# EAGLE design main_board (EAGLE 6.5.0)
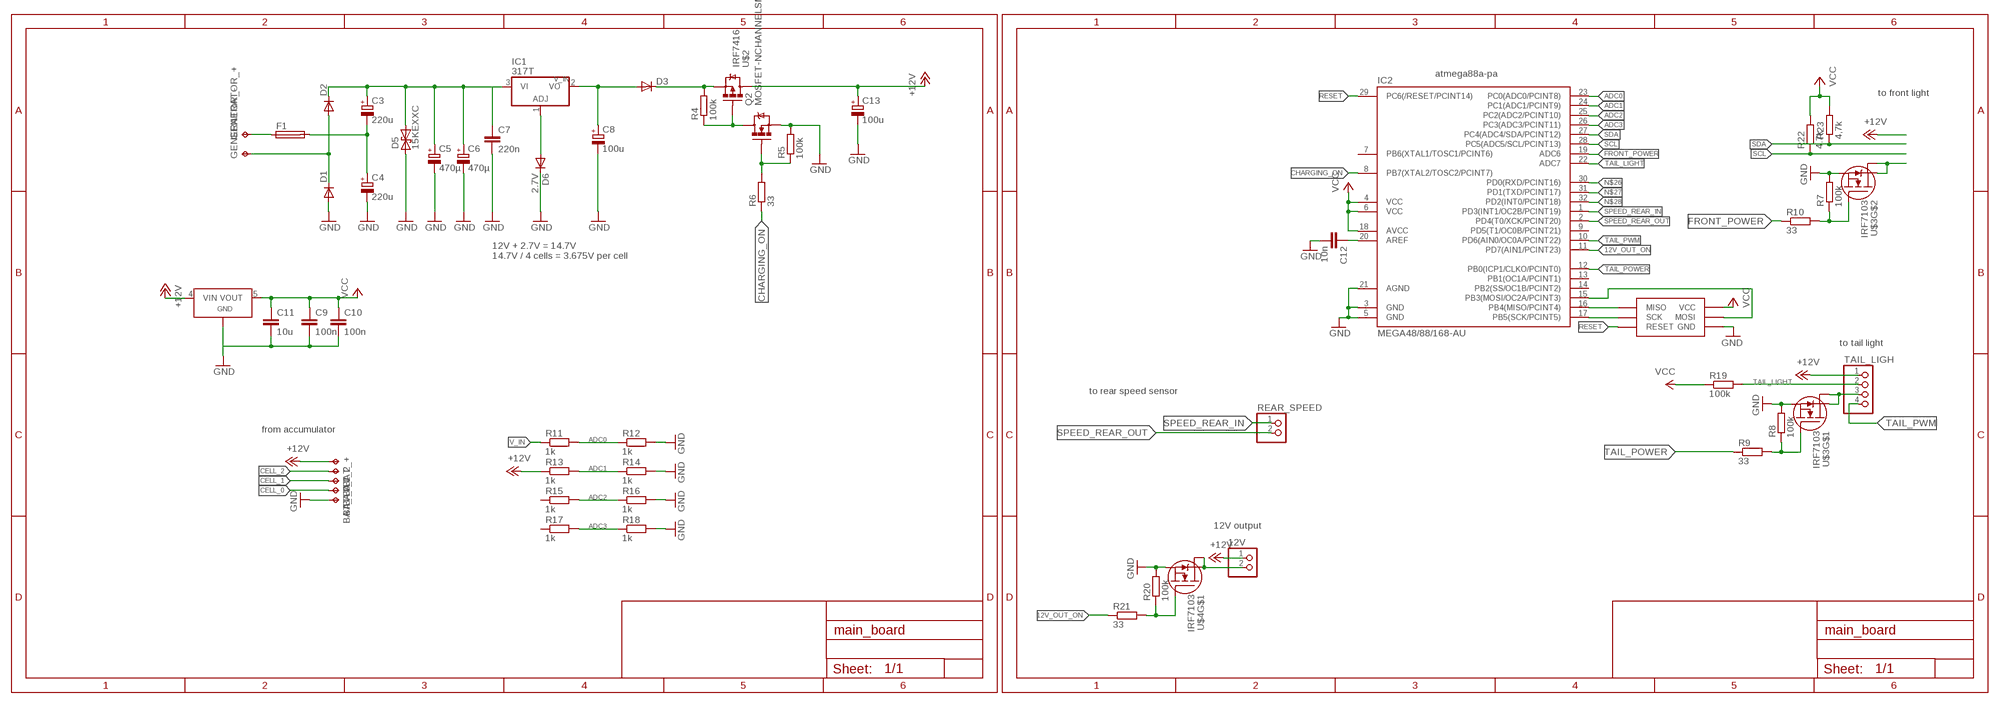
[diagram p0: schematic, sheet 1]

## Parts
12V  PINHD-1X2  [1X02]
BAT_0  TPTP18SQ  [TP18SQ]
BAT_1  TPTP18SQ  [TP18SQ]
BAT_2  TPTP18SQ  [TP18SQ]
BAT_+  TPTP18SQ  [TP18SQ]
BAT_-  TPTP18SQ  [TP18SQ]
C3  220u  CPOL-EUF  [PANASONIC_F]
C4  220u  CPOL-EUF  [PANASONIC_F]
C5  470µ  CPOL-EU153CLV-1014  [153CLV-1014]
C6  470µ  CPOL-EU153CLV-1014  [153CLV-1014]
C7  220n  C-EUC0805  [C0805]
C8  100u  CPOL-EUE  [PANASONIC_E]
C9  100n  C-EUC0805  [C0805]
C10  100n  C-EUC0805  [C0805]
C11  10u  C-EUC1206  [C1206]
C12  10n  C-EUC0805  [C0805]
C13  100u  CPOL-EUE  [PANASONIC_E]
D1  DIODE-DO-214AC  [DO-214AC]
D2  DIODE-DO-214AC  [DO-214AC]
D3  DIODE-DO-214AC  [DO-214AC]
D5  15KEXXC  [CB429-17]
D6  2.7V  DIODE-MINIMELF  [MINIMELF]
F1  TE5  [TE5]
GENERATOR_+  TPTP18SQ  [TP18SQ]
GENERATOR_-  TPTP18SQ  [TP18SQ]
IC1  317T  [TO220H]
IC2  MEGA48/88/168-AU  [TQFP32-08]
Q2  MOSFET-NCHANNELSMD  [SOT23-3]
R4  100k  R-EU_R0603  [R0603]
R5  100k  R-EU_R0603  [R0603]
R6  33  R-EU_R0603  [R0603]
R7  100k  R-EU_R0603  [R0603]
R8  100k  R-EU_R0603  [R0603]
R9  33  R-EU_R0603  [R0603]
R10  33  R-EU_R0603  [R0603]
R11  1k  R-EU_R0603  [R0603]
R12  1k  R-EU_R0603  [R0603]
R13  1k  R-EU_R0603  [R0603]
R14  1k  R-EU_R0603  [R0603]
R15  1k  R-EU_R0603  [R0603]
R16  1k  R-EU_R0603  [R0603]
R17  1k  R-EU_R0603  [R0603]
R18  1k  R-EU_R0603  [R0603]
R19  100k  R-EU_R0603  [R0603]
R20  100k  R-EU_R0603  [R0603]
R21  33  R-EU_R0603  [R0603]
R22  4.7k  R-EU_R0603  [R0603]
R23  4,7k  R-EU_R0603  [R0603]
REAR_SPEED  PINHD-1X2  [1X02]
TAIL_LIGH  PINHD-1X4  [1X04]
U$1  TPS71530  [SOT23-DBV]
U$2  IRF7416  [SO8-2]
U$3  IRF7103  [SO8-2]
U$4  IRF7103  [SO8-2]
U$5  ISP_SPECIALS  [ISP_RM2_00_STRAIGHT]

## Nets
12V_OUT_ON: IC2.11(PD7(AIN1/PCINT23)) R21.1
+12V: 12V.1 BAT_+.TP C13.+ R13.1 TAIL_LIGH.1 U$1.4(VIN) U$2.5(D1) U$2.6(D1) U$2.7(D1) U$2.8(D1)
ADC0: IC2.23(PC0(ADC0/PCINT8)) R11.2 R12.1
ADC1: IC2.24(PC1(ADC1/PCINT9)) R13.2 R14.1
ADC2: IC2.25(PC2(ADC2/PCINT10)) R15.2 R16.1
ADC3: IC2.26(PC3(ADC3/PCINT11)) R17.2 R18.1
CELL_0: BAT_0.TP
CELL_1: BAT_1.TP
CELL_2: BAT_2.TP
CHARGING_ON: IC2.8(PB7(XTAL2/TOSC2/PCINT7)) R6.1
FRONT_POWER: IC2.19(ADC6) R10.1
GND: BAT_-.TP C4.- C5.- C6.- C7.2 C8.- C9.2 C10.2 C11.2 C12.2 C13.- D1.A D5.A D6.C IC2.3(GND) IC2.5(GND) IC2.21(AGND) Q2.2(S) R5.2 R7.2 R8.2 R12.2 R14.2 R16.2 R18.2 R20.2 U$1.2(GND) U$3.1(S) U$3.3(S) U$4.1(S) U$5.VCC(GND)
N$1: D3.C R4.2 U$2.1(S1) U$2.2(S1) U$2.3(S1)
N$2: C12.1 IC2.20(AREF)
N$4: D1.C D2.A GENERATOR_-.TP
N$5: 12V.2 U$4.7(D) U$4.8(D)
N$7: IC2.17(PB5(SCK/PCINT5)) U$5.SCK
N$8: C3.- C4.+ F1.2
N$9: F1.1 GENERATOR_+.TP
N$10: D6.A IC1.1(ADJ)
N$12: IC2.16(PB4(MISO/PCINT4)) U$5.RESET(MISO)
N$13: U$3.5(D) U$3.6(D)
N$16: Q2.3(D) R4.1 U$2.4(G)
N$17: Q2.1(G) R5.1 R6.2
N$18: TAIL_LIGH.3 U$3.7(D) U$3.8(D)
N$19: R7.1 R10.2 U$3.4(G)
N$20: R8.1 R9.2 U$3.2(G)
N$21: IC2.15(PB3(MOSI/OC2A/PCINT3)) U$5.MOSI
N$22: R20.1 R21.2 U$4.2(G)
N$24: C8.+ D3.A IC1.2(VO)
N$26: IC2.30(PD0(RXD/PCINT16))
N$27: IC2.31(PD1(TXD/PCINT17))
N$28: IC2.32(PD2(INT0/PCINT18))
RESET: IC2.29(PC6(/RESET/PCINT14)) U$5.MISO(RESET)
SCL: IC2.28(PC5(ADC5/SCL/PCINT13)) R22.1
SDA: IC2.27(PC4(ADC4/SDA/PCINT12)) R23.1
SPEED_REAR_IN: IC2.1(PD3(INT1/OC2B/PCINT19)) REAR_SPEED.1
SPEED_REAR_OUT: IC2.2(PD4(T0/XCK/PCINT20)) REAR_SPEED.2
TAIL_LIGHT: IC2.22(ADC7) R19.2 TAIL_LIGH.2
TAIL_POWER: IC2.12(PB0(ICP1/CLKO/PCINT0)) R9.1
TAIL_PWM: IC2.10(PD6(AIN0/OC0A/PCINT22)) TAIL_LIGH.4
V_IN: C3.+ C5.+ C6.+ C7.1 D2.C D5.C IC1.3(VI) R11.1
VCC: C9.1 C10.1 C11.1 IC2.4(VCC) IC2.6(VCC) IC2.18(AVCC) R19.1 R22.2 R23.2 U$1.5(VOUT) U$5.GND(VCC)
Unconnected: IC2.7(PB6(XTAL1/TOSC1/PCINT6)) IC2.9(PD5(T1/OC0B/PCINT21)) IC2.13(PB1(OC1A/PCINT1)) IC2.14(PB2(SS/OC1B/PCINT2)) R15.1 R17.1 U$4.3(S) U$4.4(G) U$4.5(D) U$4.6(D)

## Notes on the sheet
- atmega88a-pa
- to front light
- 12V + 2.7V = 14.7V
  14.7V / 4 cells = 3.675V per cell
- to tail light
- to rear speed sensor
- from accumulator
- 12V output

## Library data of the parts
12V REAR_SPEED = pinhead:PINHD-1X2: PIN HEADER
BAT_0 BAT_1 BAT_2 BAT_+ BAT_- GENERATOR_+ GENERATOR_- = testpad:TP: Test pad
C3-C6 C8 C13 = resistor:CPOL-EU: POLARIZED CAPACITOR, European symbol
C7 C9-C12 = resistor:C-EU: CAPACITOR, European symbol
D1-D3 D6 = diode:DIODE-: DIODE
D5 = diode:15KEXXC: DIODE
F1 = fuse:TE5: FUSE Wickmann; OC_FARNELL: unknown; OC_NEWARK: unknown
IC1 = linear:*317: Positive VOLTAGE REGULATOR
IC2 = avr-7:MEGA48/88/168
Q2 = SparkFun:MOSFET-NCHANNEL
R4-R23 = resistor:R-EU_: RESISTOR, European symbol
TAIL_LIGH = pinhead:PINHD-1X4: PIN HEADER
U$1 = ShortCircuitRobotics:TPS71530
U$2 = ShortCircuitRobotics:IRF7416
U$3 U$4 = irf-2:IRF7103: HEXFET® Power MOSFET Adavanced Process Technology Ultra Low On-Resistance Dual N-Channel MOSFET Surface Mount Available in Tape & Reel Dynamic dv/dt Rating Fast Switching Please connect both Drain-Pins of each FET for thermal Reasons! (Pin 5 with Pin 6, 7 with 8)
U$5 = bookla:ISP_SPECIAL

## Board
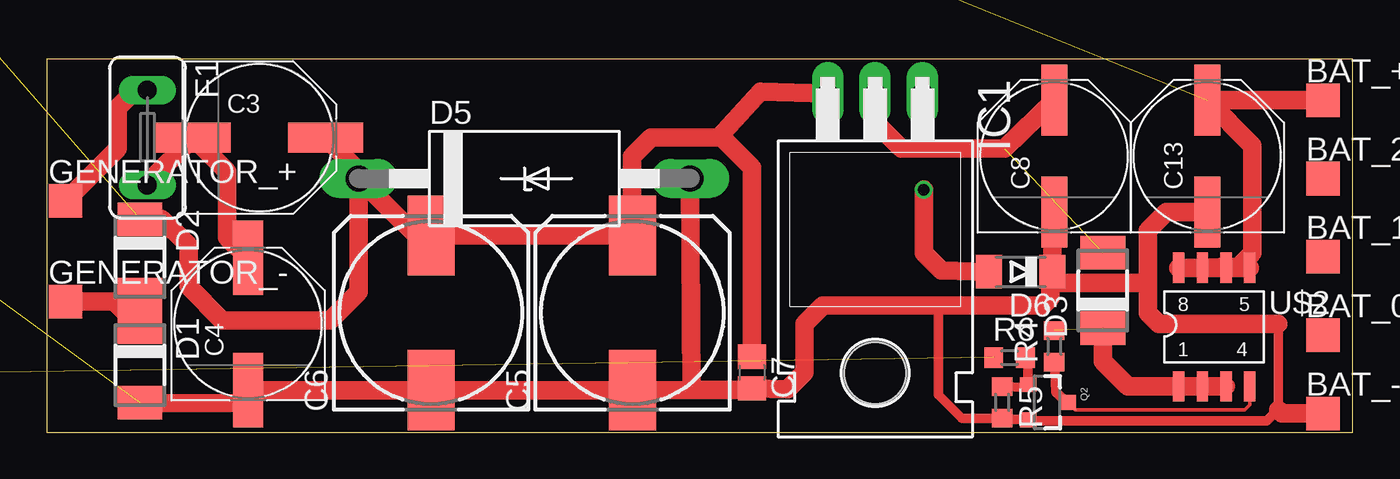
[diagram p1: board, top side]
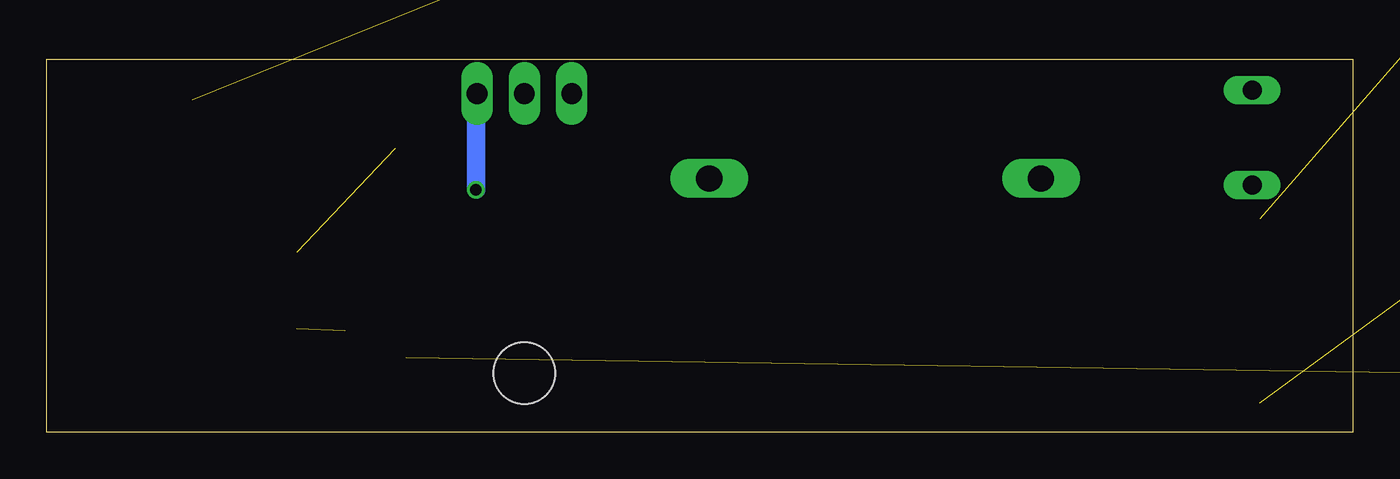
[diagram p2: board, bottom side, seen from below]

Size 70 x 20 mm. Coordinates in mm from the lower left corner, seen from the top.
Outline: 0,0 70,0 70,20 0,20 0,0
Copper layers (1*16): Top 0.0356mm / dielectric 1.5011mm / Bottom 0.0356mm
Design rules "LaenPCBOrder *": minimum track width 6mil, minimum drill 13mil, track to track 6mil, track to pad 6mil, pad to pad 6mil, via to via 6mil, smd to smd 6mil, copper to edge 15mil, drill to drill 6mil, minimum pad ring 7mil, minimum via ring 7mil, stop-mask expansion 3mil, vias tented up to drill 0mil, thermal gap 10mil

### Footprints (pad centres in the part's own frame; a part is rotated, then mirrored left to right if it is on the bottom)
1X02 = drill 1.016 long: 1 -1.27,0; 2 1.27,0
TP18SQ = smd 1.8 x 1.8: TP 0,0
PANASONIC_F = smd 4 x 1.6: + 3.55,0; - -3.55,0
153CLV-1014 = smd 4.3 x 2.5: + 4.15,0; - -4.15,0
C0805 = smd 1.3 x 1.5: 1 -0.85,0; 2 0.85,0
PANASONIC_E = smd 3.8 x 1.4: + 3,0; - -3,0
C1206 = smd 1.6 x 1.8: 1 -1.4,0; 2 1.4,0
DO-214AC = smd 1.8 x 2.4: A 2.025,0; C -2.025,0
CB429-17 = drill 1.397 long: A 8.89,0; C -8.89,0
MINIMELF = smd 1.4 x 1.8: A 1.7,0; C -1.7,0
TE5 = drill 1.016 long: 1 -2.54,0; 2 2.54,0
TO220H = drill 1.118 long: 1 -2.54,-10.16; 2 0,-10.16; 3 2.54,-10.16 | hole 3.302: 0,4.826
TQFP32-08 = smd 1.27 x 0.559: 1 -4.293,2.8; 2 -4.293,2; 3 -4.293,1.2; 4 -4.293,0.4; 5 -4.293,-0.4; 6 -4.293,-1.2; 7 -4.293,-2; 8 -4.293,-2.8; 17 4.293,-2.8; 18 4.293,-2; 19 4.293,-1.2; 20 4.293,-0.4; 21 4.293,0.4; 22 4.293,1.2; 23 4.293,2; 24 4.293,2.8 | smd 0.559 x 1.27: 9 -2.8,-4.293; 10 -2,-4.293; 11 -1.2,-4.293; 12 -0.4,-4.293; 13 0.4,-4.293; 14 1.2,-4.293; 15 2,-4.293; 16 2.8,-4.293; 25 2.8,4.293; 26 2,4.293; 27 1.2,4.293; 28 0.4,4.293; 29 -0.4,4.293; 30 -1.2,4.293; 31 -2,4.293; 32 -2.8,4.293
SOT23-3 = smd 0.8 x 0.9: 1 -0.95,-1; 2 0.95,-1; 3 0,1.1
R0603 = smd 1 x 1.1: 1 -0.85,0; 2 0.85,0
1X04 = drill 1.016 long: 1 -3.81,0; 2 -1.27,0; 3 1.27,0; 4 3.81,0
SOT23-DBV = smd 0.55 x 1.2: 1 -0.95,-1.3; 2 0,-1.3; 3 0.95,-1.3; 4 0.95,1.3; 5 -0.95,1.3
SO8-2 = smd 0.61 x 1.626: 1 -2.54,-2.54; 2 -1.27,-2.54; 3 0,-2.54; 4 1.27,-2.54; 5 1.27,3.81; 6 0,3.81; 7 -1.27,3.81; 8 -2.54,3.81
ISP_RM2_00_STRAIGHT = smd 1.5 x 1.5 bottom: GND 2,-0.85; MOSI 0,-0.85; VCC -2,-0.85 | smd 1.5 x 1.5: MISO -2,-0.85; RESET 2,-0.85; SCK 0,-0.85

### Placement (x,y rotation side)
12V  -69.8,50.8 0 top  (outside the outline)
BAT_0  68.4,5.2 0 top
BAT_1  68.4,9.4 0 top
BAT_2  68.4,13.6 0 top
BAT_+  68.4,17.8 0 top
BAT_-  68.4,1 0 top
C3  11.4,15.8 0 top
C4  10.8,5.8 90 top
C5  31.4,6.4 90 top
C6  20.6,6.4 90 top
C7  37.8,3.2 270 top
C8  54,14.8 90 top
C9  -67.4,57.2 0 top  (outside the outline)
C10  -16.6,63.4 0 top  (outside the outline)
C11  -48.2,44.4 0 top  (outside the outline)
C12  -31.8,69.8 0 top  (outside the outline)
C13  62.2,14.8 90 top
D1  5,3.6 270 top
D2  5,9.4 270 top
D3  56.6,7.6 90 top
D5  25.6,13.6 0 top
D6  52.2,8.6 180 top
F1  5.4,15.8 270 top
GENERATOR_+  1,12.4 0 top
GENERATOR_-  1,7 0 top
IC1  44.4,8 180 top
IC2  -66,5 0 top  (outside the outline)
Q2  53.6,1.6 270 top
R4  54,4.6 90 top
R5  51.2,1.6 270 top
R6  51.6,4 0 top
R7  -29.2,57.2 0 top  (outside the outline)
R8  -35.6,57.2 0 top  (outside the outline)
R9  -42,69.8 0 top  (outside the outline)
R10  -34.2,63.4 0 top  (outside the outline)
R11  -39.4,63.4 0 top  (outside the outline)
R12  -44.4,63.4 0 top  (outside the outline)
R13  -49.6,63.4 0 top  (outside the outline)
R14  -54.6,63.4 0 top  (outside the outline)
R15  -59.6,63.4 0 top  (outside the outline)
R16  -64.8,63.4 0 top  (outside the outline)
R17  -69.8,63.4 0 top  (outside the outline)
R18  -16.6,69.8 0 top  (outside the outline)
R19  -42,57.2 0 top  (outside the outline)
R20  -48.2,57.2 0 top  (outside the outline)
R21  -21.6,69.8 0 top  (outside the outline)
R22  -22.8,63.4 0 top  (outside the outline)
R23  -29.2,63.4 0 top  (outside the outline)
REAR_SPEED  -52,50.8 0 top  (outside the outline)
TAIL_LIGH  -61,50.8 0 top  (outside the outline)
U$1  -63.4,35.6 0 top  (outside the outline)
U$2  63.2,5 0 top
U$3  -38,35.6 0 top  (outside the outline)
U$4  -52,35.6 0 top  (outside the outline)
U$5  -21.6,75 0 top  (outside the outline)

### Tracks (layer width: path | path; a pad name or v marks a point on that pad's centre or on a via)
12V_OUT_ON  (1 unrouted)
+12V  (4 unrouted)
  Top 1: U$2.5 U$2.6 U$2.7 U$2.8 63.88,8.88 64.6,9.6 64.6,15.37 C13.+ BAT_+.TP
ADC0  (2 unrouted)
ADC1  (2 unrouted)
ADC2  (2 unrouted)
ADC3  (2 unrouted)
CHARGING_ON  (1 unrouted)
FRONT_POWER  (1 unrouted)
GND  (19 unrouted)
  Top 0.5: 66,5.8 66,1.2 65.4,0.6 52.65,0.6 Q2.2 52.48,0.7 51.25,0.7 R5.2 49.05,0.75 47.8,2 47.8,6.6 47.6,6.8
  Top 1: D1.A 10.76,1.55 C4.- C6.- C5.- 34.6,2.27 | 34.6,2.27 37.81,2.27 C7.2 39.7,2.3 40.6,3.2 40.6,5.8 41.6,6.8 47.6,6.8 53.4,6.8 53.8,7.2 53.8,8 | D5.A 34.56,2.31 34.6,2.27 | 53.8,8 53.8,8.6 D6.C 53.86,12.26 54,12.4 C8.- | 53.8,8 59,8 | 59,8 59,6.4 59.6,5.8 66,5.8 | C13.- 60,11.8 59,10.8 59,8 | BAT_-.TP 66.2,1 66,1.2
N$1  (1 unrouted)
  Top 1: U$2.3 U$2.2 U$2.1 57.94,2.46 56.6,3.8 D3.C
N$2  (1 unrouted)
N$4
  Top 1: GENERATOR_-.TP 3.62,7 | 3.62,7 D1.C | 3.62,7 4.62,7 D2.A
N$5  (2 unrouted)
N$7  (1 unrouted)
N$8
  Top 1: C4.+ 9.67,10.44 9.67,13.97 C3.- 5.4,13.35 F1.2
N$9
  Top 1: F1.1 4.74,18.34 3.8,17.4 3.8,15.2 GENERATOR_+.TP
N$10  (via drill 0.6)
  Top 1: D6.A 47.94,8.66 47,9.6 v47,13
  Bottom 1: v47,13 47,18.41 IC1.1
N$12  (1 unrouted)
N$13  (1 unrouted)
N$16
  Top 0.2: 54.9,1.4 Q2.3 55.1,1.2 64.2,1.2 64.47,1.47 U$2.4
  Top 0.5: R4.1 54.09,2.14 Q2.3
N$17
  Top 0.5: R5.1 52.42,2.4 Q2.1 52.55,3.92 R6.2
N$18  (2 unrouted)
N$19  (2 unrouted)
N$20  (2 unrouted)
N$21  (1 unrouted)
N$22  (2 unrouted)
N$24  (1 unrouted)
  Top 1: IC1.2 44.41,16.59 45.8,15.2 51.33,15.2 C8.+
RESET  (1 unrouted)
SCL  (1 unrouted)
SDA  (1 unrouted)
SPEED_REAR_IN  (1 unrouted)
SPEED_REAR_OUT  (1 unrouted)
TAIL_LIGHT  (2 unrouted)
TAIL_POWER  (1 unrouted)
TAIL_PWM  (1 unrouted)
V_IN  (1 unrouted)
  Top 1: D5.C 16.78,13.96 C3.+ | D5.C 19.79,10.57 C6.+ C5.+ 31.37,14.77 32.4,15.8 36,15.8 | 36,15.8 36.2,15.8 37.8,14.2 C7.1 | IC1.3 38.26,18.26 36,15.8 | D2.C 6.17,11.43 7.6,10 7.6,7.8 9.4,6 15.2,6 16.71,7.51 D5.C
VCC  (10 unrouted)